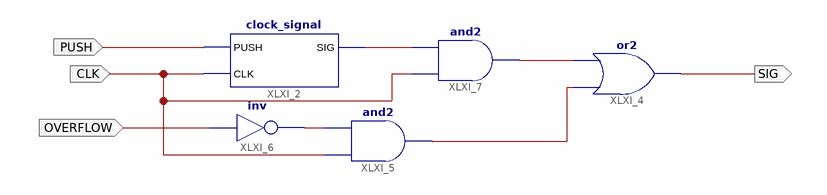
[diagram p0: schematic sheet 1]
// Xilinx ISE schematic Bypass_CLK.sch (spartan3e) as structural Verilog: 5 symbols, 4 ports
module Bypass_CLK (
  input  PUSH,
  input  CLK,
  input  OVERFLOW,
  output SIG
);

  wire XLXN_5, XLXN_7, XLXN_16, XLXN_20;

  clock_signal XLXI_2 (.PUSH(PUSH), .CLK(CLK), .SIG(XLXN_20));
  or XLXI_4 (SIG, XLXN_7, XLXN_16);
  and XLXI_5 (XLXN_7, CLK, XLXN_5);
  not XLXI_6 (XLXN_5, OVERFLOW);
  and XLXI_7 (XLXN_16, CLK, XLXN_20);
endmodule
